# EasyEDA Pro project mikroprosesor Tugas Praktek.eprj

# Schematic Schematic2
Create Date: 2025-10-18; Page Name: P1; Project Name: mikroprosesor; Schematic Name: Schematic2; Update Date: 2025-10-18; Company: EasyEDA.com; Page Size: A4; Version: V1.0
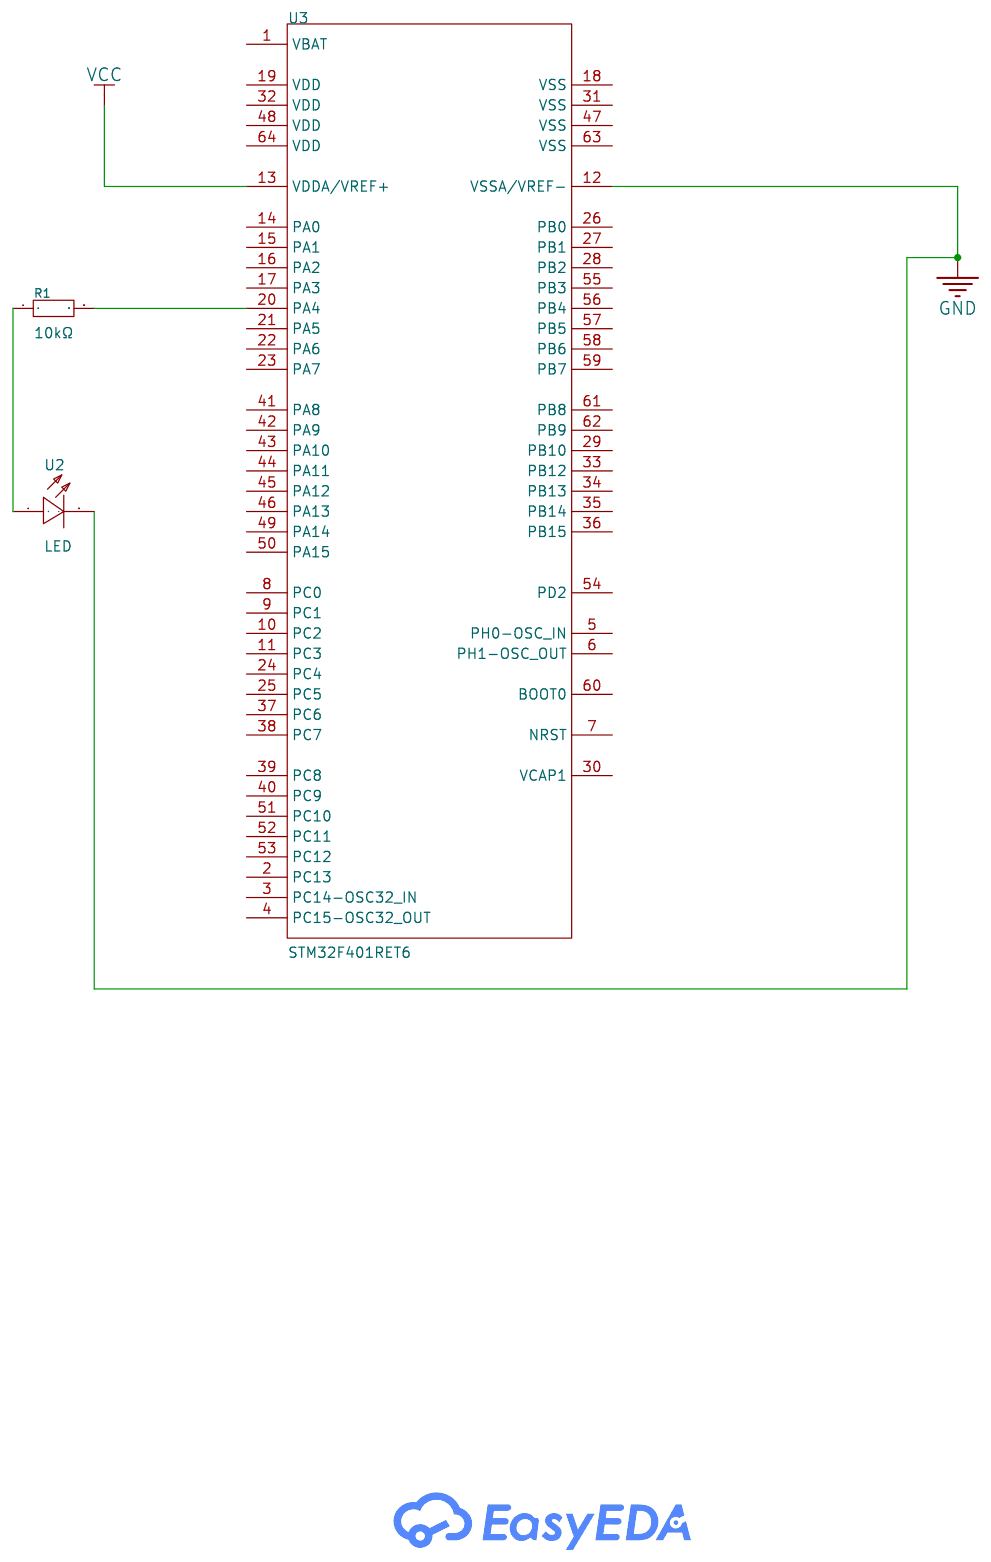
[diagram p0: schematic sheet]

## Parts
R1  10kΩ  [R1206]
U2  LED  [LED-TH_BD4.0-P2.54-FD_RED]
U3  STM32F401RET6  [LQFP-64_L10.0-W10.0-P0.50-LS12.0-BL]

## Library data of the parts
R1 = 1206W4F1002T5E: Type:Thick Film Resistor Resistance:10kΩ Tolerance:±1% Tolerance:±1% Power(Watts):250mW Voltage-Supply(Max):200V Temperature Coefficient:±100ppm/℃ Temperature Coefficient:±100ppm/℃ Operating Temperature:-55℃~+155℃ Operating Temperature:-55℃~+155℃; LCSC Part Name: 10kΩ ±1% 250mW 厚膜电阻; Supplier Part: C17902; Manufacturer: UNI-ROYAL(厚声); Supplier Footprint: 1206; JLCPCB Part Class: Basic Part; Datasheet: https://item.szlcsc.com/datasheet/1206W4F1002T5E/18590.html; Supplier: LCSC; Type: Thick Film Resistor; Tolerance: ±1%; Power(Watts): 250mW; Voltage-Supply(Max): 200V; Temperature Coefficient: ±100ppm/℃; Operating Temperature: -55℃~+155℃
U2 = LED: Supplier Part: C9900015665; Supplier Footprint: SIP-2P; JLCPCB Part Class: Extended Part; Supplier: LCSC
U3 = STM32F401RET6: CPU Core:ARM-M4 CPU Maximum Speed:84MHz Program Storage Size:512KB Number of I/O:50 ADC (Bit):12bit Voltage - Supply:1.7V~3.6V Voltage - Supply:1.7V~3.6V Applications:-; LCSC Part Name: 带DSP和FPU的STM32动态效率ARM Cortex-M4 MCU，具有最大512 KB Flash、84 MHz CPU和ART加速器; Supplier Part: C116978; Manufacturer: ST(意法半导体); Supplier Footprint: LQFP-64(10x10); JLCPCB Part Class: Extended Part; Datasheet: https://atta.szlcsc.com/upload/public/pdf/source/20180130/C161736_15172973410651323369.pdf; Supplier: LCSC; CPU Core: ARM-M4; CPU Maximum Speed: 84MHz; Program Storage Size: 512KB; Number of I/O: 50; ADC (Bit): 12bit; Voltage - Supply: 1.7V~3.6V

## Nets
GND: U2.2(-) U3.12(VSSA/VREF-)
VCC: U3.13(VDDA/VREF+)
Net-(R1-1): R1.1 U2.1(+)
Net-(R1-2): R1.2 U3.20(PA4)

Not connected (* = marked no-connect by the designer): U3 1(VBAT) 2(PC13) 3(PC14-OSC32_IN) 4(PC15-OSC32_OUT) 5(PH0-OSC_IN) 6(PH1-OSC_OUT) 7(NRST) 8(PC0) 9(PC1) 10(PC2) 11(PC3) 14(PA0) 15(PA1) 16(PA2) 17(PA3) 18(VSS) 19(VDD) 21(PA5) 22(PA6) 23(PA7) 24(PC4) 25(PC5) 26(PB0) 27(PB1) 28(PB2) 29(PB10) 30(VCAP1) 31(VSS) 32(VDD) 33(PB12) 34(PB13) 35(PB14) 36(PB15) 37(PC6) 38(PC7) 39(PC8) 40(PC9) 41(PA8) 42(PA9) 43(PA10) 44(PA11) 45(PA12) 46(PA13) 47(VSS) 48(VDD) 49(PA14) 50(PA15) 51(PC10) 52(PC11) 53(PC12) 54(PD2) 55(PB3) 56(PB4) 57(PB5) 58(PB6) 59(PB7) 60(BOOT0) 61(PB8) 62(PB9) 63(VSS) 64(VDD)
